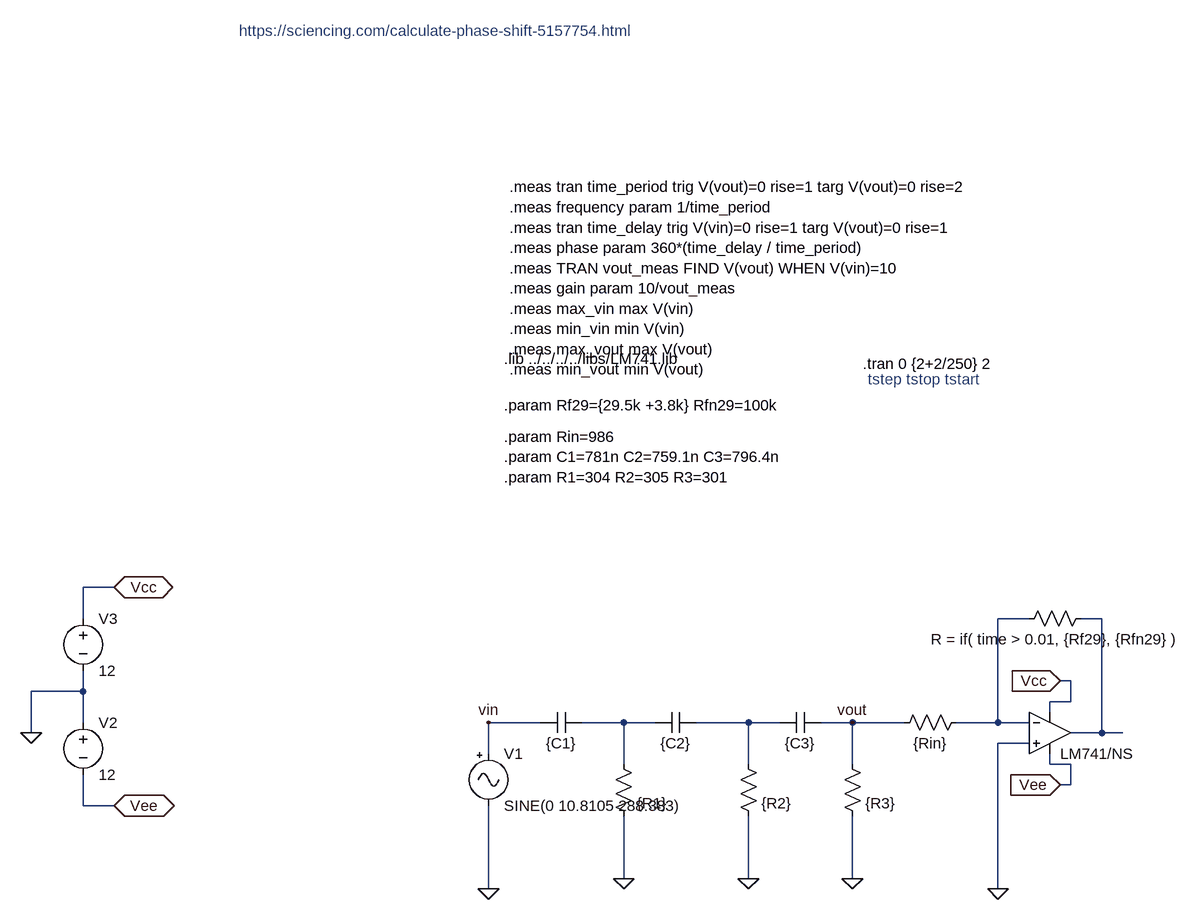
[diagram p0: schematic debugB_practical.asc]
debugB_practical.asc, the LTspice schematic file:
Version 4
SHEET 1 1332 1128
WIRE -704 -80 -752 -80
WIRE -752 -32 -752 -80
WIRE 704 -32 656 -32
WIRE 816 -32 784 -32
WIRE 768 64 752 64
WIRE -752 80 -752 48
WIRE -752 80 -832 80
WIRE 768 96 768 64
WIRE 768 96 736 96
WIRE 736 112 736 96
WIRE -752 128 -752 80
WIRE -48 128 -128 128
WIRE 80 128 16 128
WIRE 128 128 80 128
WIRE 272 128 192 128
WIRE 320 128 272 128
WIRE 432 128 384 128
WIRE 512 128 432 128
WIRE 656 128 656 -32
WIRE 656 128 592 128
WIRE 704 128 656 128
WIRE -832 144 -832 80
WIRE 816 144 816 -32
WIRE 816 144 768 144
WIRE 848 144 816 144
WIRE 704 160 656 160
WIRE -128 176 -128 128
WIRE 80 192 80 128
WIRE 272 192 272 128
WIRE 432 192 432 128
WIRE 736 192 736 176
WIRE 768 192 736 192
WIRE 768 224 768 192
WIRE 768 224 752 224
WIRE -752 256 -752 208
WIRE -704 256 -752 256
WIRE 80 368 80 272
WIRE 272 368 272 272
WIRE 432 368 432 272
WIRE -128 384 -128 256
WIRE 656 384 656 160
FLAG 80 368 0
FLAG 272 368 0
FLAG 752 64 Vcc
IOPIN 752 64 In
FLAG 752 224 Vee
IOPIN 752 224 In
FLAG 656 384 0
FLAG 432 368 0
FLAG -832 144 0
FLAG -704 -80 Vcc
IOPIN -704 -80 BiDir
FLAG -704 256 Vee
IOPIN -704 256 BiDir
FLAG 432 128 vout
FLAG -128 128 vin
FLAG -128 384 0
SYMBOL opamp2 736 80 R0
WINDOW 0 16 32 Invisible 2
SYMATTR InstName U1
SYMATTR Value LM741/NS
SYMBOL res 800 -48 R90
WINDOW 0 0 56 Invisible 2
WINDOW 3 32 56 VTop 2
SYMATTR InstName R1
SYMATTR Value R = if( time > 0.01, {Rf29}, {Rfn29} )
SYMBOL res 608 112 R90
WINDOW 0 0 56 Invisible 2
WINDOW 3 32 56 VTop 2
SYMATTR InstName R2
SYMATTR Value {Rin}
SYMBOL cap 16 112 R90
WINDOW 0 0 32 Invisible 2
WINDOW 3 32 32 VTop 2
SYMATTR InstName C1
SYMATTR Value {C1}
SYMBOL cap 192 112 R90
WINDOW 0 0 32 Invisible 2
WINDOW 3 32 32 VTop 2
SYMATTR InstName C2
SYMATTR Value {C2}
SYMBOL cap 384 112 R90
WINDOW 0 0 32 Invisible 2
WINDOW 3 32 32 VTop 2
SYMATTR InstName C3
SYMATTR Value {C3}
SYMBOL res 64 176 R0
WINDOW 0 36 40 Invisible 2
SYMATTR InstName R3
SYMATTR Value {R1}
SYMBOL res 256 176 R0
WINDOW 0 36 40 Invisible 2
SYMATTR InstName R4
SYMATTR Value {R2}
SYMBOL res 416 176 R0
WINDOW 0 36 40 Invisible 2
SYMATTR InstName R5
SYMATTR Value {R3}
SYMBOL voltage -752 112 R0
SYMATTR InstName V2
SYMATTR Value 12
SYMBOL voltage -752 -48 R0
SYMATTR InstName V3
SYMATTR Value 12
SYMBOL Misc/signal -128 160 R0
SYMATTR InstName V1
SYMATTR Value SINE(0 10.8105 288.383)
TEXT -104 -432 Left 2 !.lib ../../../../libs/LM741.lib
TEXT -104 -312 Left 2 !.param Rin=986\n.param C1=781n C2=759.1n C3=796.4n\n.param R1=304 R2=305 R3=301
TEXT 448 -424 Left 2 !.tran 0 {2+2/250} 2
TEXT 456 -400 Left 2 ;tstep tstop tstart
TEXT -104 -360 Left 2 !.param Rf29={29.5k +3.8k} Rfn29=100k
TEXT -96 -696 Left 2 !.meas tran time_period trig V(vout)=0 rise=1 targ V(vout)=0 rise=2\n.meas frequency param 1/time_period\n.meas tran time_delay trig V(vin)=0 rise=1 targ V(vout)=0 rise=1\n.meas phase param 360*(time_delay / time_period)\n.meas TRAN vout_meas FIND V(vout) WHEN V(vin)=10\n.meas gain param 10/vout_meas\n.meas max_vin max V(vin)\n.meas min_vin min V(vin)\n.meas max_vout max V(vout)\n.meas min_vout min V(vout)
TEXT -512 -936 Left 2 ;https://sciencing.com/calculate-phase-shift-5157754.html

The netlist it stands for:
* debugB_practical.asc
XU1 0 N001 Vcc Vee N002 LM741/NS  ; pins In+ In- V+ V- OUT
R1 N002 N001 R = if( time > 0.01, {Rf29}, {Rfn29} )
R2 N001 vout {Rin}
C1 N003 vin {C1}
C2 N004 N003 {C2}
C3 vout N004 {C3}
R3 N003 0 {R1}
R4 N004 0 {R2}
R5 vout 0 {R3}
V2 0 Vee 12
V3 Vcc 0 12
V1 vin 0 SINE(0 10.8105 288.383)
.lib ../../../../libs/LM741.lib
.param Rin=986
.param C1=781n C2=759.1n C3=796.4n
.param R1=304 R2=305 R3=301
.tran 0 {2+2/250} 2
* tstep tstop tstart
.param Rf29={29.5k +3.8k} Rfn29=100k
.meas tran time_period trig V(vout)=0 rise=1 targ V(vout)=0 rise=2
.meas frequency param 1/time_period
.meas tran time_delay trig V(vin)=0 rise=1 targ V(vout)=0 rise=1
.meas phase param 360*(time_delay / time_period)
.meas TRAN vout_meas FIND V(vout) WHEN V(vin)=10
.meas gain param 10/vout_meas
.meas max_vin max V(vin)
.meas min_vin min V(vin)
.meas max_vout max V(vout)
.meas min_vout min V(vout)
* https://sciencing.com/calculate-phase-shift-5157754.html
.backanno
.end